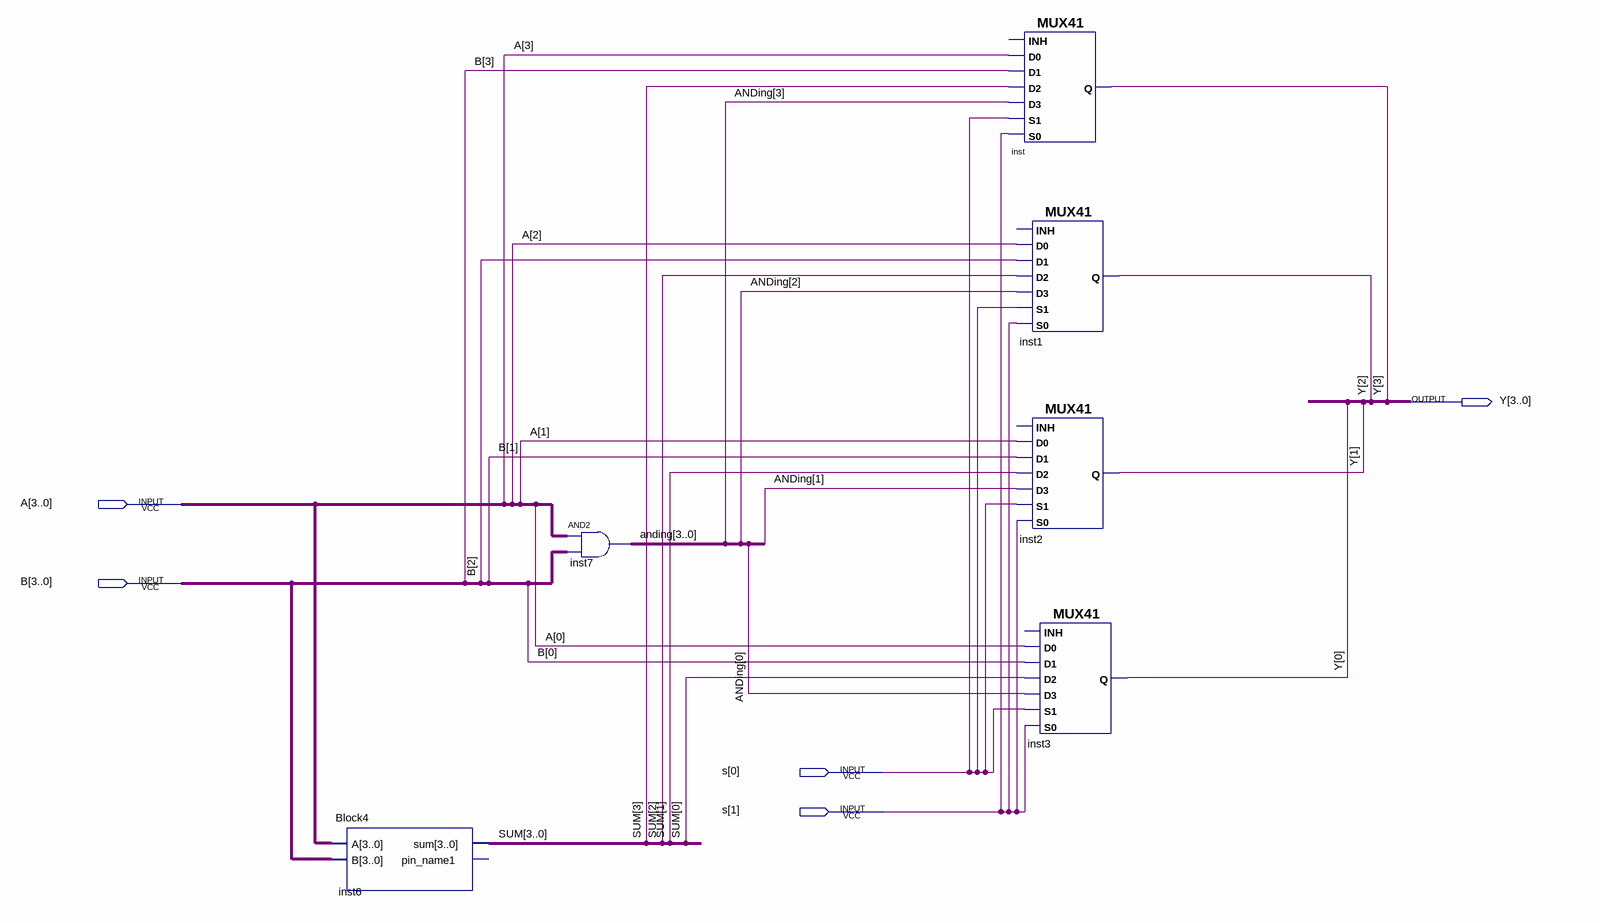
[diagram p0: schematic sheet]
// Quartus schematic Block5.bdf as structural Verilog: 6 symbols, 5 pins
module Block5 (
  input  [3:0] A,
  input  [3:0] B,
  input  [1:0] s,
  output [3:0] Y
);

  wire [3:0] anding, SUM;

  Block4 inst6 (.A(A), .B(B), .sum(SUM));  // open: pin_name1
  assign anding = A & B;  // AND2 inst7, 4 bits wide
  MUX41 inst (.S0(s[1]), .D2(SUM[3]), .S1(s[0]), .D3(anding[3]), .D0(A[3]), .D1(B[3]), .Q(Y[3]));  // open: INH
  MUX41 inst1 (.S0(s[1]), .D2(SUM[2]), .S1(s[0]), .D3(anding[2]), .D0(A[2]), .D1(B[2]), .Q(Y[2]));  // open: INH
  MUX41 inst2 (.S0(s[1]), .D2(SUM[1]), .S1(s[0]), .D3(anding[1]), .D0(A[1]), .D1(B[1]), .Q(Y[1]));  // open: INH
  MUX41 inst3 (.S0(s[1]), .D2(SUM[0]), .S1(s[0]), .D3(anding[0]), .D0(A[0]), .D1(B[0]), .Q(Y[0]));  // open: INH
endmodule
